# EAGLE schematic untitled (EAGLE 9.6.2)
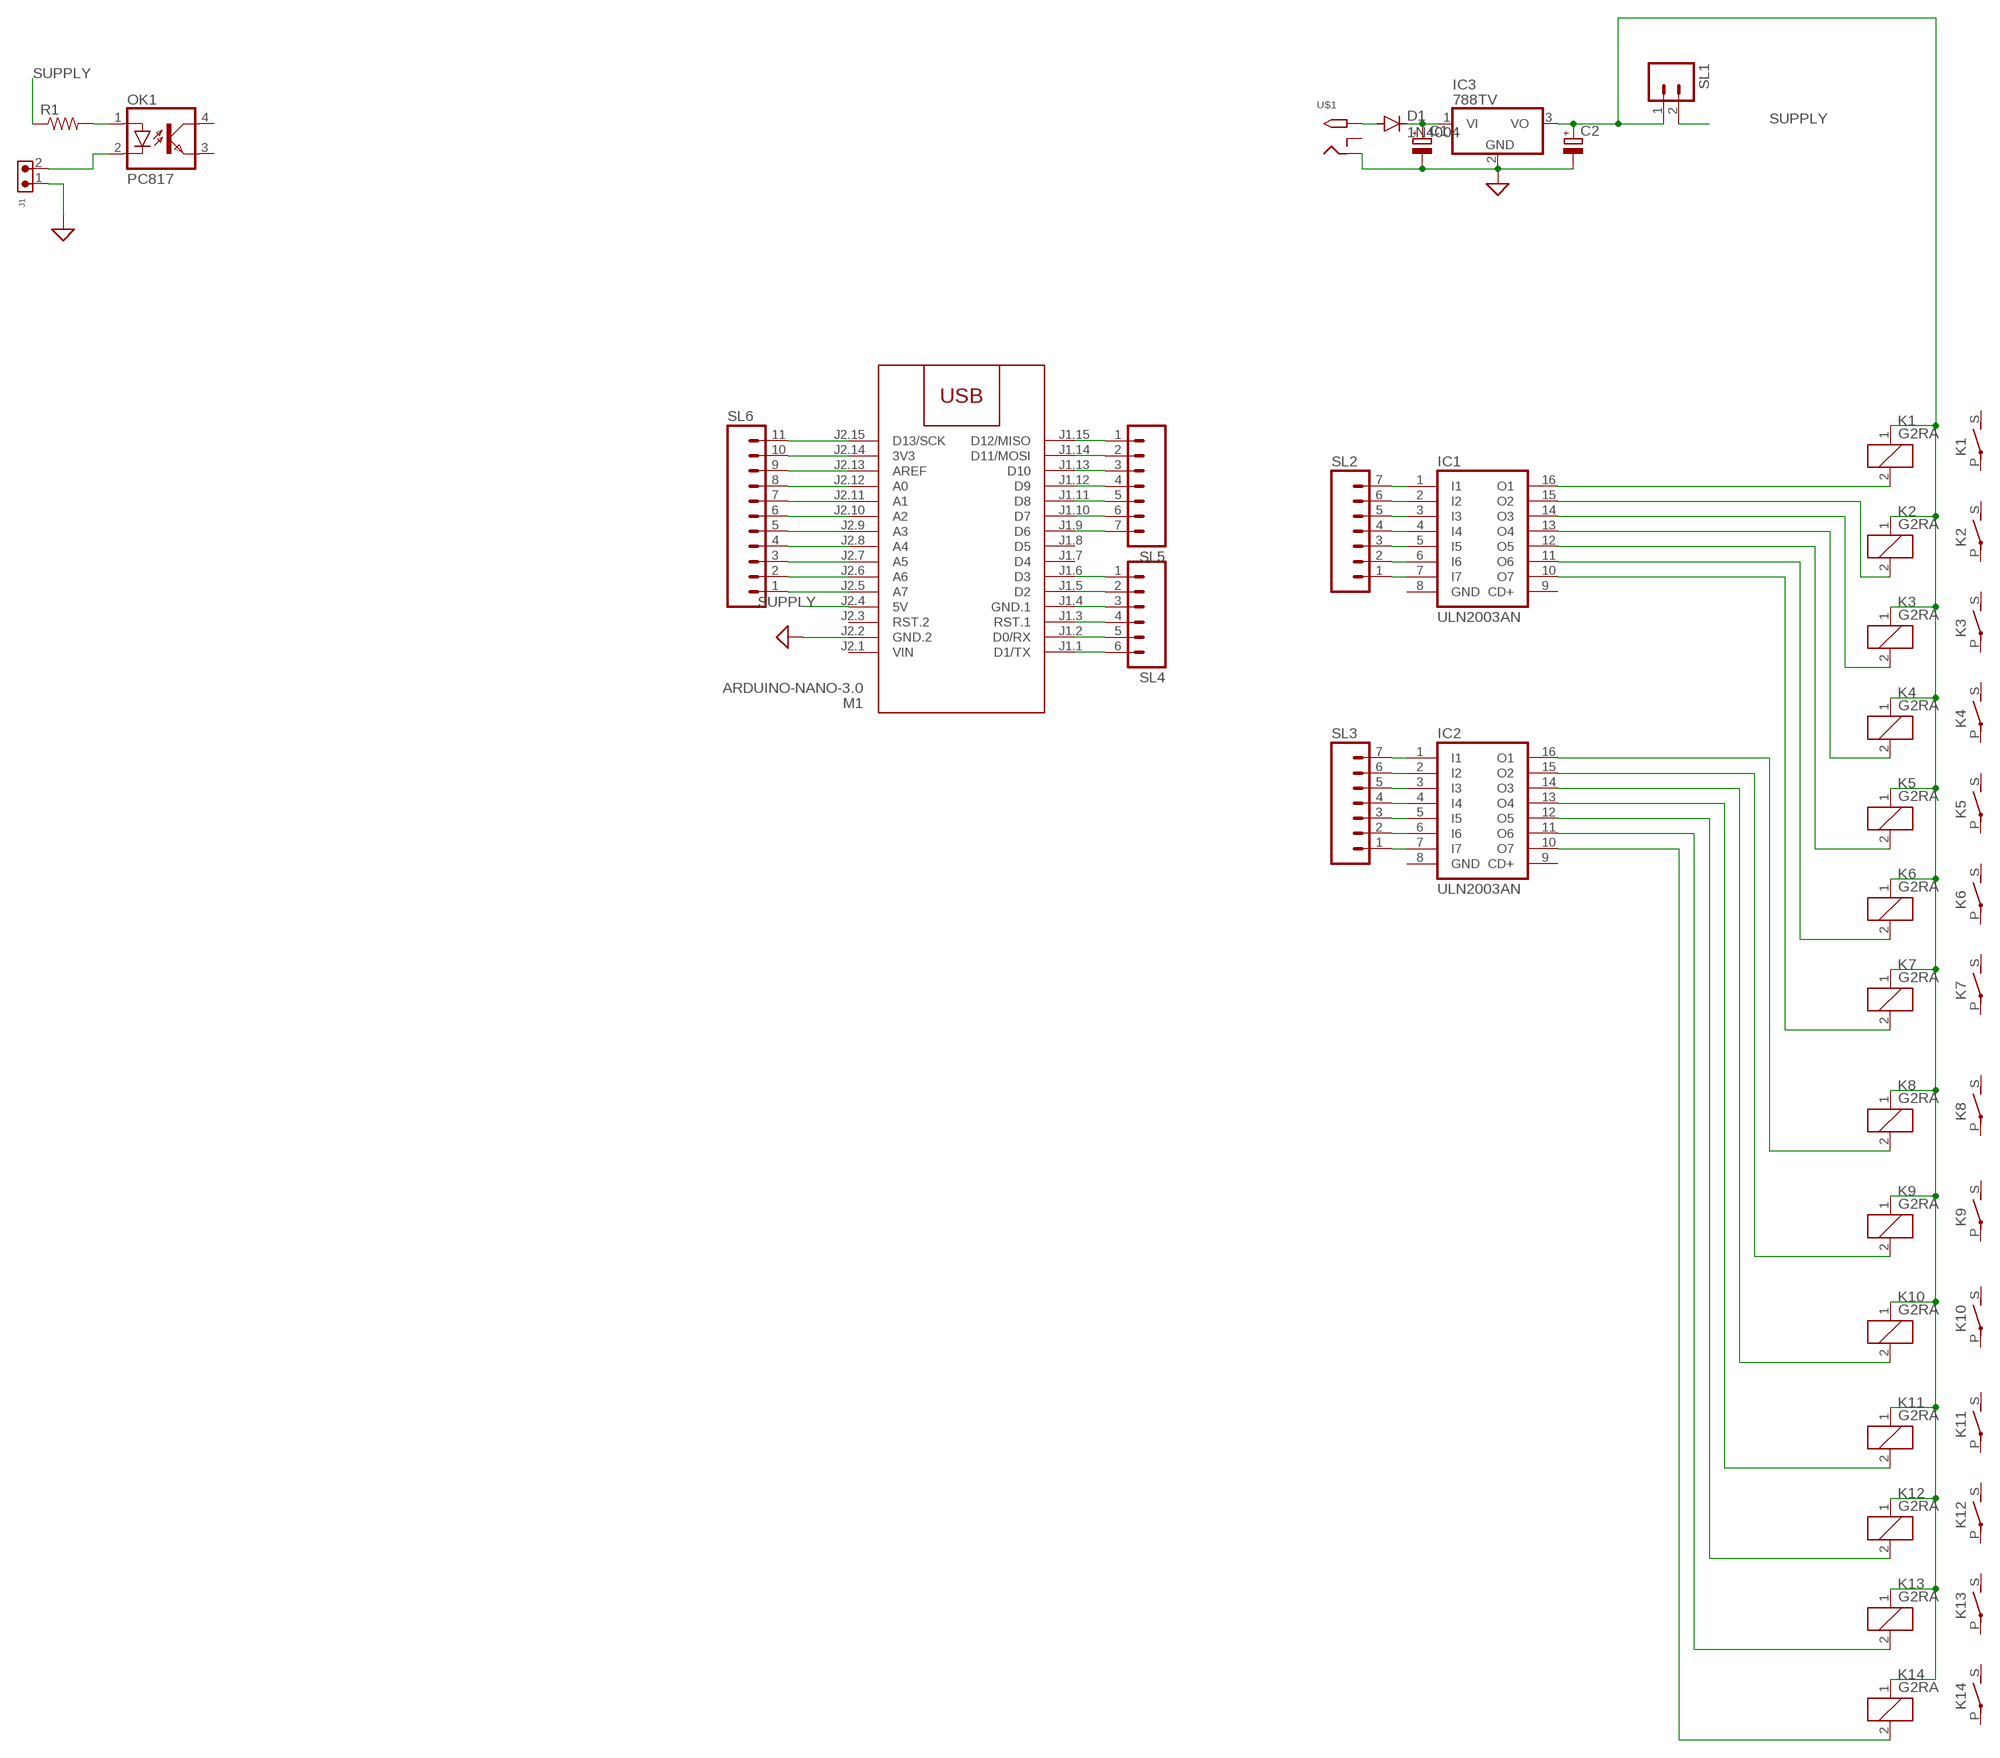
[diagram p0: schematic, sheet 1]

## Parts
C1  CPOL-EUE2.5-6  [E2,5-6]
C2  CPOL-EUE2.5-6  [E2,5-6]
D1  1N4004  [DO41-10]
IC1  ULN2003AN  [DIL16]
IC2  ULN2003AN  [DIL16]
IC3  788TV  [TO220V]
J1  691305530002  [691305530002]
K1  G2RA  [G2RA]
K2  G2RA  [G2RA]
K3  G2RA  [G2RA]
K4  G2RA  [G2RA]
K5  G2RA  [G2RA]
K6  G2RA  [G2RA]
K7  G2RA  [G2RA]
K8  G2RA  [G2RA]
K9  G2RA  [G2RA]
K10  G2RA  [G2RA]
K11  G2RA  [G2RA]
K12  G2RA  [G2RA]
K13  G2RA  [G2RA]
K14  G2RA  [G2RA]
M1  ARDUINO-NANO-3.0  [ARDUINO-NANO-3.0]
OK1  PC817  [DIL04]
R1  R-US_0207/7  [0207/7]
SL1  M02  [02P]
SL2  M07  [07P]
SL3  M07  [07P]
SL4  M06  [06P]
SL5  M07  [07P]
SL6  M11  [11P]
U$1  2.1MMJACKTHM  [PJ-102A]

## Nets
GND: C1.- C2.- IC3.2(GND) J1.1 M1.J2.2(GND.2) U$1.RING ; supply symbol labelled SUP
N$1: IC1.16(O1) K1.2
N$2: IC1.15(O2) K2.2
N$3: IC1.14(O3) K3.2
N$4: IC1.13(O4) K4.2
N$5: IC1.12(O5) K5.2
N$6: IC1.11(O6) K6.2
N$7: IC1.10(O7) K7.2
N$8: IC2.16(O1) K8.2
N$9: IC2.15(O2) K9.2
N$10: IC2.14(O3) K10.2
N$11: IC2.13(O4) K11.2
N$12: IC2.12(O5) K12.2
N$13: IC2.11(O6) K13.2
N$14: IC2.10(O7) K14.2
N$15: D1.A U$1.TIP
N$16: C1.+ D1.C IC3.1(VI)
N$17: IC1.7(I7) SL2.1
N$18: C2.+ IC3.3(VO) K1.1 K2.1 K3.1 K4.1 K5.1 K6.1 K7.1 K8.1 K9.1 K10.1 K11.1 K12.1 K13.1 K14.1 SL1.1
N$19: IC1.6(I6) SL2.2
N$20: IC1.5(I5) SL2.3
N$21: IC1.4(I4) SL2.4
N$22: IC1.3(I3) SL2.5
N$23: IC1.2(I2) SL2.6
N$24: IC1.1(I1) SL2.7
N$25: IC2.7(I7) SL3.1
N$26: IC2.6(I6) SL3.2
N$27: IC2.5(I5) SL3.3
N$28: IC2.4(I4) SL3.4
N$29: IC2.3(I3) SL3.5
N$30: IC2.2(I2) SL3.6
N$31: IC2.1(I1) SL3.7
N$32: M1.J1.6(D3) SL4.1
N$33: M1.J1.5(D2) SL4.2
N$34: M1.J1.4(GND.1) SL4.3
N$35: M1.J1.3(RST.1) SL4.4
N$36: M1.J1.2(D0/RX) SL4.5
N$37: M1.J1.1(D1/TX) SL4.6
N$38: M1.J1.15(D12/MISO) SL5.1
N$39: M1.J1.14(D11/MOSI) SL5.2
N$40: M1.J1.13(D10) SL5.3
N$41: M1.J1.12(D9) SL5.4
N$42: M1.J1.11(D8) SL5.5
N$43: M1.J1.10(D7) SL5.6
N$44: M1.J1.9(D6) SL5.7
N$45: M1.J2.5(A7) SL6.1
N$46: M1.J2.6(A6) SL6.2
N$47: M1.J2.7(A5) SL6.3
N$48: M1.J2.8(A4) SL6.4
N$49: M1.J2.9(A3) SL6.5
N$50: M1.J2.10(A2) SL6.6
N$51: M1.J2.11(A1) SL6.7
N$52: M1.J2.12(A0) SL6.8
N$53: M1.J2.13(AREF) SL6.9
N$54: M1.J2.14(3V3) SL6.10
N$55: M1.J2.15(D13/SCK) SL6.11
N$56: J1.2 OK1.2(C)
N$57: OK1.1(A) R1.2
SUPPLY: M1.J2.4(5V) R1.1 SL1.2
Unconnected: IC1.9(CD+) IC2.9(CD+) K1.P(2:P) K1.S(2:S) K2.P(2:P) K2.S(2:S) K3.P(2:P) K3.S(2:S) K4.P(2:P) K4.S(2:S) K5.P(2:P) K5.S(2:S) K6.P(2:P) K6.S(2:S) K7.P(2:P) K7.S(2:S) K8.P(2:P) K8.S(2:S) K9.P(2:P) K9.S(2:S) K10.P(2:P) K10.S(2:S) K11.P(2:P) K11.S(2:S) K12.P(2:P) K12.S(2:S) K13.P(2:P) K13.S(2:S) K14.P(2:P) K14.S(2:S) M1.J1.7(D4) M1.J1.8(D5) M1.J2.3(RST.2) OK1.3(EMIT) OK1.4(COL) U$1.RING_SW

## Power pins joined to a net without a drawn wire
GND: IC1.8(GND) IC2.8(GND)
VIN: M1.J2.1(VIN)

## Library data of the parts
C1 C2 = rcl:CPOL-EU: POLARIZED CAPACITOR, European symbol; SPICEPREFIX: C
D1 = diode:1N4004: DIODE general purpose rectifier, 1 A
IC1 IC2 = uln-udn:ULN2003A: DRIVER ARRAY
IC3 = linear:78*: Positive VOLTAGE REGULATOR Source: http://cache.national.com/ds/LM/LM78L05.pdf http://www.fairchildsemi.com/ds/LM/LM7805.pdf
J1 = Wurth_Connectors_WR-TBL Pluggable Connector:691305530002: WR-TBL Serie 3055 - 5,08 mm - PCB Header Vertical Entry with Plastic Latches KIND PROPERTIES Pitch 5.08 mm MATERIAL PROPERTIES Insulator Material PA66 Insulator Flammability Rating UL94 V-0 Insulator Color Green Terminal Material Copper Alloy Terminal Plating Tin-plated surface GENERAL INFORMATION Operating Temperature -40 up to +105 °C ELECTRICAL PROPERTIES IR UL 16 A Working Voltage [UL] 300 V (AC) Withstanding Voltage [UL] 2500 V (AC) Contact Resistance [UL] 20 mΩ CERTIFICATION UL Approval E315414 <https://www.we-online.com/catalog/media/o135349v209%20Family_WR-TBL3_6913055300xx.jpg> Details see: https://www.we-online.com/catalog/en/TBL_5_08_3055_6913055300XX/ Updated by Ella Wu 2019-12-30 2019(C) Wurth Elektronik; DATASHEET-URL: https://www.we-online.com/catalog/datasheet/691305530002.pdf; IR-UL: 16A; MOUNT: THT; PART-NUMBER: 691305530002; PINS: 2; PITCH: 5.08mm; TYPE: Vertical; WORKING-VOLTAGE-UL: 300V (AC)
K1-K14 = relay:G2RA: RELAY 1 x norm. open, Omron; OC_FARNELL: unknown; OC_NEWARK: unknown
M1 = diy-modules:ARDUINO-NANO-3.0: Arduino Nano 3.0 and compatible devices More details available here: https://www.arduino.cc/en/Main/ArduinoBoardNano Click here to find device on ebay.com <http://www.ebay.com/sch/arduino+nano>
OK1 = optocoupler:PC817: SHARP OPTO COUPLER; MPN: PC817X4J000F; OC_FARNELL: 9707727; OC_NEWARK: 97K7059
R1 = BeagleBone_Black_Wireless:R-US_: RESISTOR, American symbol
SL1 = con-amp-quick:M02: AMP QUICK CONNECTOR; OC_FARNELL: unknown; OC_NEWARK: unknown
SL2 SL3 SL5 = con-amp-quick:M07: AMP QUICK CONNECTOR; OC_FARNELL: unknown; OC_NEWARK: unknown
SL4 = con-amp-quick:M06: AMP QUICK CONNECTOR; OC_FARNELL: unknown; OC_NEWARK: unknown
SL6 = con-amp-quick:M11: AMP QUICK CONNECTOR; OC_FARNELL: unknown; OC_NEWARK: unknown
U$1 = adafruit:2.1MMJACK: 2.1mm x 5.5mm THM DC jack with internal switch. Digikey part #PJ-102A, 4UCON part #05537 2.1mm x 5.5mm SMT DC jack with internal switch. Digikey part #PJ-002A-SMT, 4UCON part #03267 By microbuilder.eu & adafruit.com